# Altium schematic sheet RightBar3_SchDoc.SchDoc
size A4
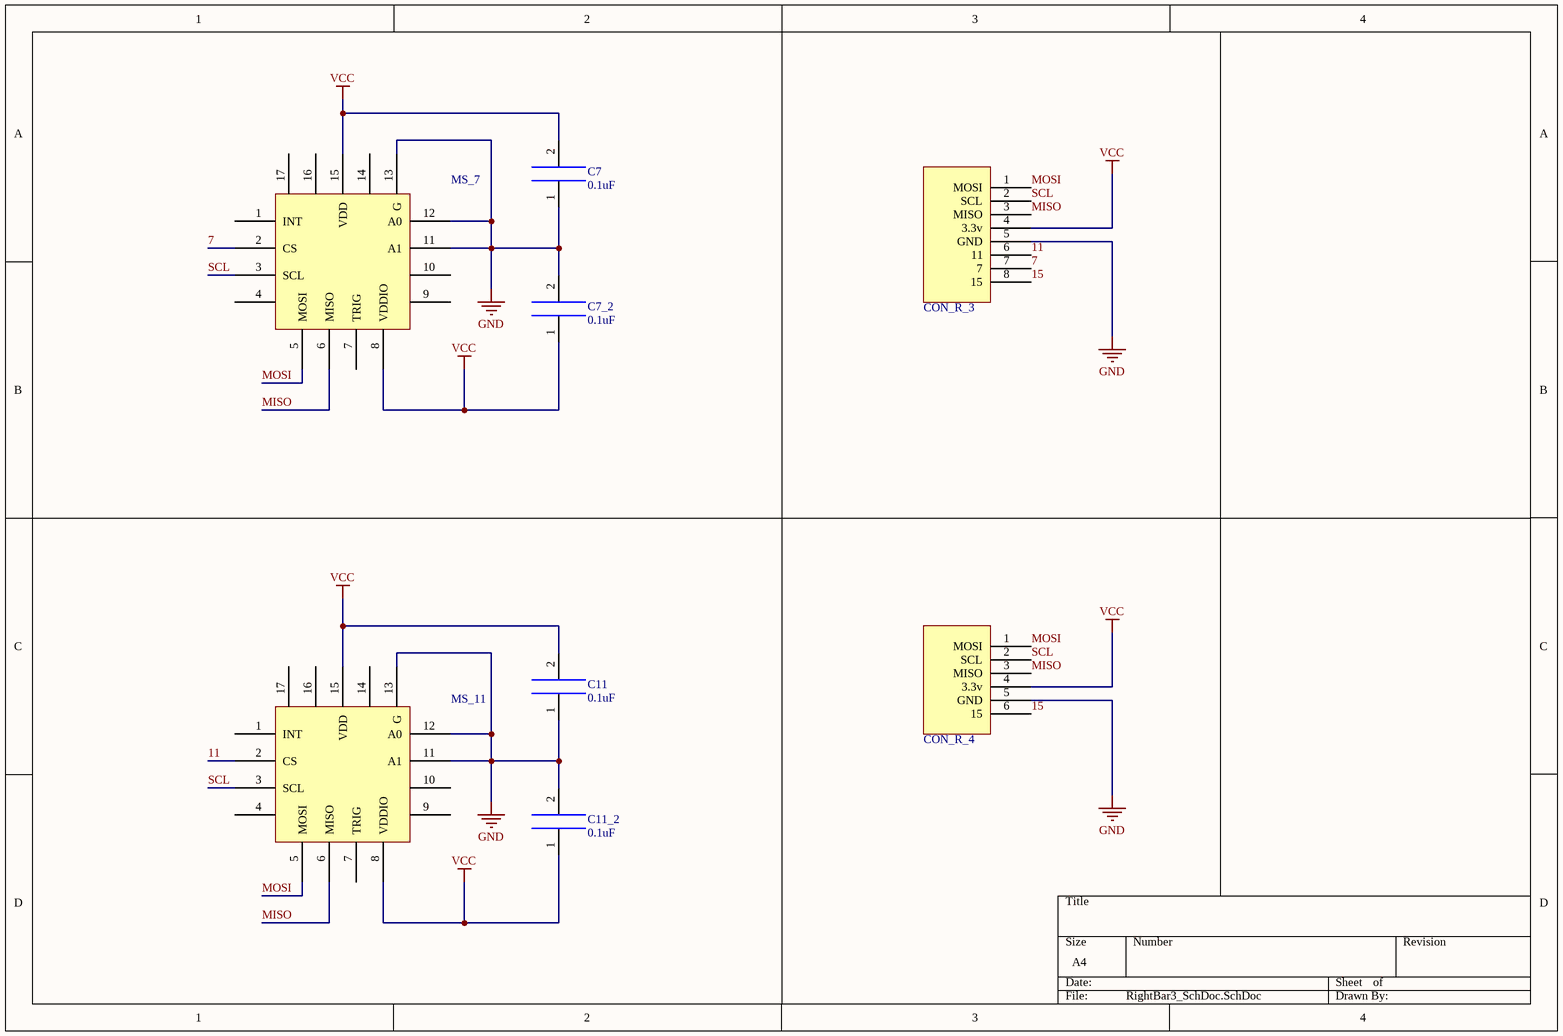
[diagram p0: RightBar3_SchDoc.SchDoc]

## Parts
C7  0.1uF  [CAP_0603]
C7_2  0.1uF  [CAP_0603]
C11  0.1uF  [CAP_0603]
C11_2  0.1uF  [CAP_0603]
CON_R_3  PIN_right  [PIN_RIGHT_3]  (value not drawn)
CON_R_4  PIN_right  [PIN_RIGHT_4]  (value not drawn)
MS_7  MLX90393SLW ABA 011 RE  [MLX90393]  (value not drawn)
MS_11  MLX90393SLW ABA 011 RE  [MLX90393]  (value not drawn)

## Nets
GND: C7.1 C7_2.2 C11.1 C11_2.2 CON_R_3.5(GND) CON_R_4.5(GND) MS_7.11(A1) MS_7.12(A0) MS_7.13(G) MS_11.11(A1) MS_11.12(A0) MS_11.13(G)
VCC: C7.2 C7_2.1 C11.2 C11_2.1 CON_R_3.4(3.3v) CON_R_4.4(3.3v) MS_7.8(VDDIO) MS_7.15(VDD) MS_11.8(VDDIO) MS_11.15(VDD)
7: CON_R_3.7 MS_7.2(CS)
11: CON_R_3.6(11) MS_11.2(CS)
15: CON_R_3.8(15) CON_R_4.6(15)
MISO: CON_R_3.3(MISO) CON_R_4.3(MISO) MS_7.6(MISO) MS_11.6(MISO)
MOSI: CON_R_3.1(MOSI) CON_R_4.1(MOSI) MS_7.5(MOSI) MS_11.5(MOSI)
SCL: CON_R_3.2(SCL) CON_R_4.2(SCL) MS_7.3(SCL) MS_11.3(SCL)

Not connected (* = marked no-connect by the designer): MS_7 1(INT) 4 7(TRIG) 9 10 14 16 17; MS_11 1(INT) 4 7(TRIG) 9 10 14 16 17

## Library data of the parts
C7 C7_2 C11 C11_2 = CAP: Capacitance
CON_R_3 = PIN_right_3
CON_R_4 = PIN_right_4
MS_7 MS_11 = MLX90393SLW ABA 011 RE: MLX90393 Sensor